# Altium schematic sheet Relay_USBtoUART.SchDoc
size A4; SheetNumber: 3; SheetTotal: 3
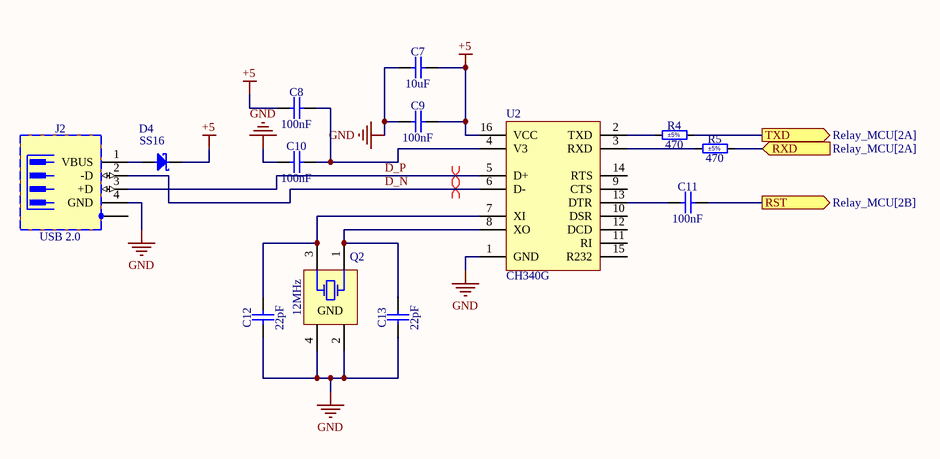
[diagram p0: Relay_USBtoUART.SchDoc]

## Parts
C7  10uF  [CAPC2012X135N]
C8  100nF  [CAPC2012X135N]
C9  100nF  [CAPC2012X135N]
C10  100nF  [CAPC2012X135N]
C11  100nF  [CAPC2012X135N]
C12  22pF  [CAPC2012X88N]
C13  22pF  [CAPC2012X88N]
D4  SS16  [DIOM5127X229N]
J2  USB 2.0  [ASSMANN_A-USBSB]
Q2  12MHz  [XTAL_EPSON_TSX-3225]
R4  470  Tolerance: ±5%  [RESC2012X60N]
R5  470  Tolerance: ±5%  [RESC2012X60N]
U2  CH340G  [SOIC-16]

## Ports
RST (out, see Relay_MCU[2B]), RXD (in, see Relay_MCU[2A]), TXD (out, see Relay_MCU[2A])

## Nets
+5: C7.2 C8.1 C9.2 D4.1(C) U2.16(VCC)
GND: C7.1 C9.1 C10.1 C12.1 C13.1 J2.4(GND) Q2.2(GND) Q2.4(GND) U2.1(GND)
D_N: J2.2(-D) U2.6(D-)
D_P: J2.3(+D) U2.5(D+)
RST: C11.2 ; port RST
RXD: R5.2 ; port RXD
TXD: R4.2 ; port TXD
NetC8_2: C8.2 C10.2 U2.4(V3)
NetC11_1: C11.1 U2.13(DTR)
NetC12_2: C12.2 Q2.3(X) U2.7(XI)
NetC13_2: C13.2 Q2.1(X) U2.8(XO)
NetD4_2: D4.2(A) J2.1(VBUS)
NetR4_1: R4.1 U2.2(TXD)
NetR5_1: R5.1 U2.3(RXD)

Not connected (* = marked no-connect by the designer): J2 5(SHIELD); U2 9(CTS) 10(DSR) 11(RI) 12(DCD) 14(RTS) 15(R232)

## Layout directives
differential pair: D_N, D_P

## Library data of the parts
C7 = CC0805_10UF_10V_10%_X7R: Non-polarised capacitor; Part Description: SMD Multilayer Chip Ceramic Capacitor; Manufacturer: GENERIC; Manufacturer1 Part Number: GRM21BR71A106KE51L; Voltage: 10V; TC: X7R; Tolerance: ±10%; Part Number: CC0805_10UF_10V_10%_X7R; Component Kind: Standard; Component Type: Standard; Pin Count: 2; Value: 10uF; Status: Preferred; Manufacturer Part Number: CC0805_10UF_10V_10%_X7R; Case: 0805; Mounted: Yes; Socket: No; SMD: Yes; Sense: No; Manufacturer1 Example: MURATA; Manufacturer1 ComponentHeight: 1.35mm; HelpURL: \\cern.ch\dfs\Applications\Altium\Datasheets\CC0805_X7R_MURATA.pdf; Author: CERN DEM JLC; CreateDate: 30.04.2012; LatestRevisionDate: 30.04.2012
C8-C11 = CC0805_100NF_50V_10%_X7R: Non-polarised capacitor; Part Description: SMD Multilayer Chip Ceramic Capacitor; Manufacturer: GENERIC; Manufacturer1 Part Number: C2012X7R1H104K085; Voltage: 50V; TC: X7R; Tolerance: ±10%; Part Number: CC0805_100NF_50V_10%_X7R; Component Kind: Standard; Component Type: Standard; Pin Count: 2; Value: 100nF; Status: None; Manufacturer Part Number: CC0805_100NF_50V_10%_X7R; Case: 0805; Mounted: Yes; Socket: No; SMD: Yes; Sense: No; Manufacturer1 Example: TDK; Manufacturer1 ComponentHeight: 1mm; HelpURL: \\cern.ch\dfs\Applications\Altium\Datasheets\CC0805_X7R_TDK_C.pdf; Author: CERN DEM JLC; CreateDate: 3.12.2007; LatestRevisionDate: 22.04.2015
C12 C13 = CC0805_22PF_200V_5%_C0G: Non-polarised capacitor; Part Description: SMD Multilayer Chip Ceramic Capacitor; Manufacturer: GENERIC; Manufacturer1 Part Number: C0805C220J2GAC; Voltage: 200V; TC: C0G/NP0; Tolerance: ±5%; Part Number: CC0805_22PF_200V_5%_C0G; Component Kind: Standard; Component Type: Standard; Pin Count: 2; Value: 22pF; Status: None; Manufacturer Part Number: CC0805_22PF_200V_5%_C0G; Case: 0805; Mounted: Yes; Socket: No; SMD: Yes; Sense: No; Manufacturer1 Example: KEMET; Manufacturer1 ComponentHeight: 0.88mm; HelpURL: \\cern.ch\dfs\Applications\Altium\Datasheets\CC0805_C0G_KEMET_(Commercial Grade).pdf; Author: CERN DEM MR; CreateDate: 2.06.2016; LatestRevisionDate: 2.06.2016
D4 = SS16: Schottky Diode; Part Description: Surface Mount Schottky Barrier Rectifier; Manufacturer: VISHAY GENERAL SEMICONDUCTOR; Voltage: 60V; Power: 1A; PressFit: No; Bonding: No; Part Number: SS16; Component Kind: Standard; Component Type: Standard; Device: SS16; PackageDescription: DO-214-AC/SMA Diode, Molded Body; 5.10mm L X 2.67mm W X 2.29mm H, IPC Medium Density; Manufacturer Part Number: SS16; Pin Count: 2; Case: DO-214AC; Mounted: Yes; Socket: No; SMD: Yes; Sense: No; ComponentHeight: 2.29mm; HelpURL: \\cern.ch\dfs\Applications\Altium\Datasheets\SS16.pdf; Author: CERN DEM JLC; CreateDate: 15.07.2008; LatestRevisionDate: 23.08.2010
J2 = ASSMANN_A-USBSB: 4 Pin + 1 Shield USB Receptacle; Part Description: USB 2.0 Style B Right Angle 4 Contacts Receptacle; PressFit: No; Part Number: ASSMANN_A-USBSB; Component Kind: Standard; Component Type: Standard; Pin Count: 5; Family: USB 2.0; Mounted: Yes; Socket: No; SMD: No; Sense: No; Status: None; Manufacturer: ASSMANN; Manufacturer Part Number: A-USBSB; ComponentHeight: 10.85mm; HelpURL: \\cern.ch\dfs\Applications\Altium\Datasheets\ASSMANN_A-USBSB.pdf; Author: CERN DEM JLC; CreateDate: 17.04.2018; LatestRevisionDate: 17.04.2018
Q2 = XTAL_40MHZ_EPSON_TSX-3225 40.0000MF10Z-B6: Crystal 4 pins 1=XTAL Control 2=GND3=XTAL 4=GND; Part Number: XTAL_12MHZ_EPSON_TSX-3225 12.0000MF10Z-B6; Part Description: Tolerance: ±10ppm,  Stability:±10ppm, -20°C to 75°C, 10pF, Surface Mount Quartz Crystal, TX-3225 Series; Manufacturer: EPSON; Manufacturer Part Number: TSX-3225 12.0000MF10Z-B6; PressFit: No; Bonding: No; Component Kind: Standard; Component Type: Standard; PackageDescription: Crystal, Corner Concave; 4 Pin, 2.50mm L X 3.20mm W X 0.6mm H, TSX-3225 Serie; Value: 12MHz; Pin Count: 4; Mounted: Yes; Socket: No; SMD: Yes; Sense: No; ComponentHeight: 0.6mm; HelpURL: \\cern.ch\dfs\Applications\Altium\Datasheets\XTAL_EPSON_TSX-3225.pdf; ComponentLink1URL: \\cern.ch\dfs\Applications\Altium\Datasheets\XTAL_EPSON_TSX-3225_Ordering-Informations.pdf; ComponentLink1Description: Ordering Informations; Author: CERN DEM HF; CreateDate: 24.10.2023; LatestRevisionDate: 24.10.2023
R4 R5 = R0805_470R_1%_0.125W_100PPM: Resistor - 5%; Part Number: R0805_470R_5%_0.125W_100PPM; Part Description: General Purpose Thick Film Chip Resistor; Manufacturer: GENERIC; Manufacturer1 Part Number: NRC10F4700TRF; Power: 0.125W; TC: ±100ppm/°C; PressFit: No; Component Kind: Standard; Component Type: Standard; Pin Count: 2; Value: 470; Status: Preferred; Manufacturer Part Number: R0805_470R_5%_0.125W_100PPM; Case: 0805; Mounted: Yes; Sense: No; Socket: No; SMD: Yes; Manufacturer1 Example: NIC COMPONENT; Manufacturer1 ComponentHeight: 0.6mm; HelpURL: \\cern.ch\dfs\Applications\Altium\Datasheets\R0805_NIC_NRC.pdf; Author: CERN DEM JLC; CreateDate: 3.12.2007; LatestRevisionDate: 13.03.2008
U2 = CH340G: USB to UART Converter SOP16; Manufacturer Part Number: CH340G